# Altium project Hall-Effect-Switch.PrjPcb
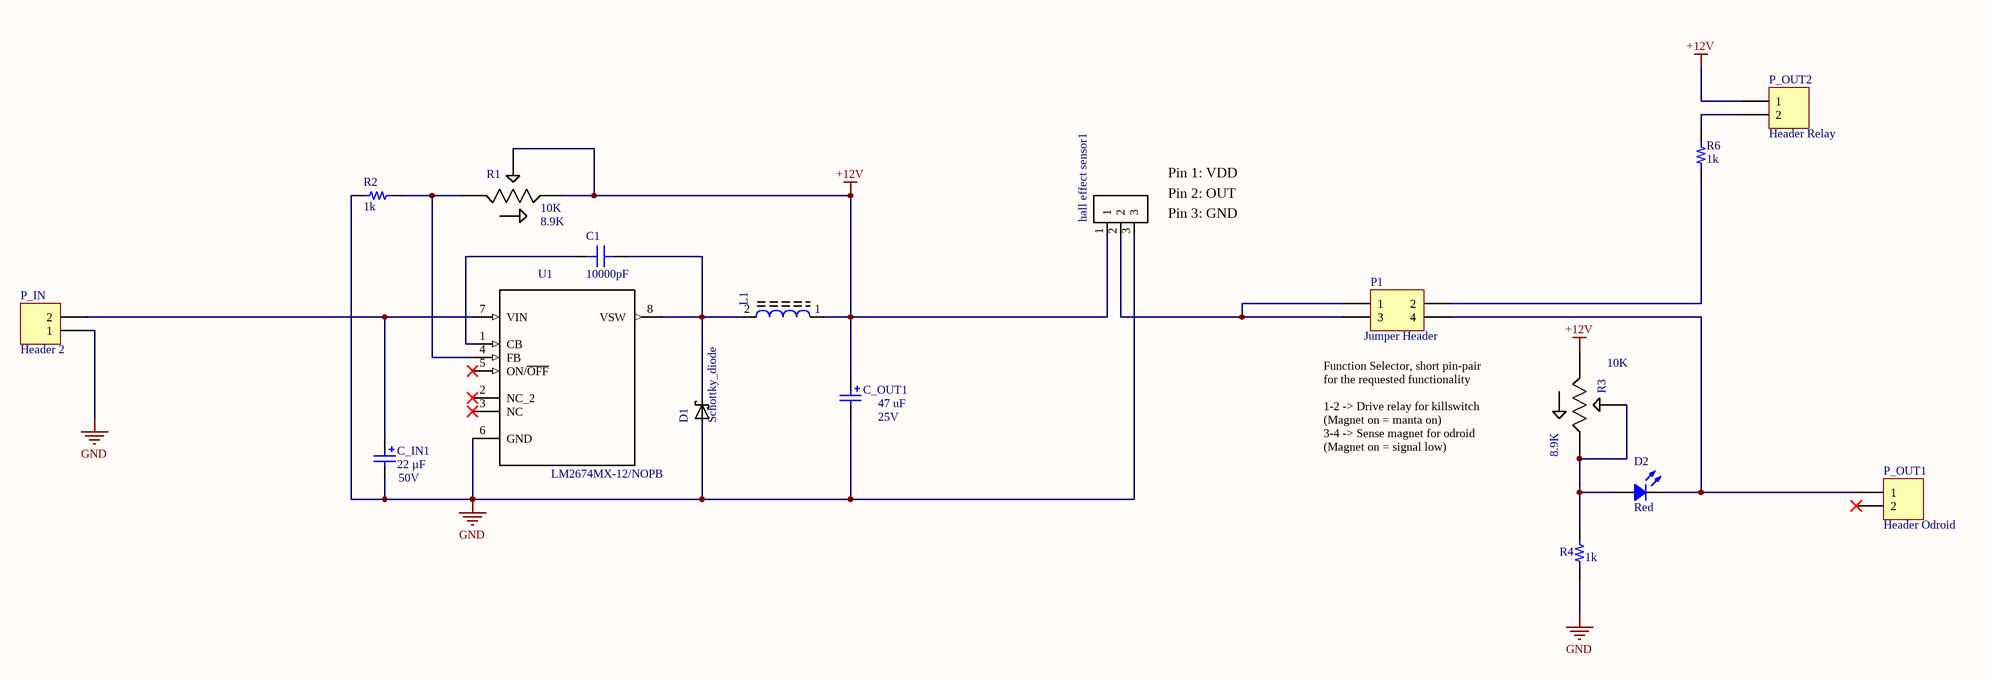
[diagram p0: Hall-Effect-Switch.SchDoc]
1 sheet, 17 parts. Net scope: global (net labels, ports and power ports of the same name join across sheets).
Board file: Hall-Effect-Switch.PcbDoc

## Sheet Hall-Effect-Switch.SchDoc
size A3; CompanyName: VORTEX NTNU

### Parts
C1  10000pF  [CAP 0805/2012]
C_IN1  22 µF  Voltage Rating: 50V  [CAPMP7361X375]
C_OUT1  47 uF  Voltage Rating: 25V  [CAPCP7343X430N]
D1  Schottky_diode  [DIOM7959X250N]
D2  Red  [LED 0603/1608 RED]
hall_effect_sensor1  (no value)  [US5881LSE-AAA-000-RE]
L1  SRR1260-680M  [SRR1260-680M]  (value not drawn)
P1  Jumper Header  [HDR2X2]
P_IN  Header 2  [HDR1X2]
P_OUT1  Header Odroid  [HDR1X2]
P_OUT2  Header Relay  [HDR1X2]
R1  8.9K  value 10K  [*35WR]
R2  1k  [RES 0805/2012]
R3  8.9K  value 10K  [*35WR]
R4  1k  [RES 0805/2012]
R6  1k  [RES 0805/2012]
U1  LM2674MX-12/NOPB  [LM2674MX-12_NOPB]

### Nets
+12V: C_OUT1.1 hall_effect_sensor1.1 L1.1 P_OUT2.1 R1.2 R1.3 R3.1
GND: C_IN1.2 C_OUT1.2 D1.2(A) hall_effect_sensor1.3 P_IN.1 R2.1 R4.1 U1.6(GND)
NetC1_1: C1.1 U1.1(CB)
NetC1_2: C1.2 D1.1(C) L1.2 U1.8(VSW)
NetC_IN1_1: C_IN1.1 P_IN.2 U1.7(VIN)
NetD2_1: D2.1 R3.2 R3.3 R4.2
NetD2_2: D2.2 P1.4 P_OUT1.1
Nethall_effect_sensor1_2: hall_effect_sensor1.2 P1.1 P1.3
NetP1_2: P1.2 R6.1
NetP_OUT2_2: P_OUT2.2 R6.2
NetR1_1: R1.1 R2.2 U1.4(FB)

Not connected (* = marked no-connect by the designer): P_OUT1 2*; U1 2(NC_2)* 3(NC)* 5(ON/~{OFF})*

### Notes on the sheet
- (near hall_effect_sensor1) Pin 1: VDD
- (near hall_effect_sensor1) Pin 2: OUT
- (near hall_effect_sensor1) Pin 3: GND
- (near P1) Function Selector, short pin-pair for the requested functionality
  1-2 -> Drive relay for killswitch (Magnet on = manta on)
  3-4 -> Sense magnet for odroid (Magnet on = signal low)
- Title
- Size
- Author
- Rev
- A3
- Sheet no.
- of

### Library data of the parts
C1 = C2012C0G1H103J060AA: CAP CER 10000PF 50V C0G 0805; Manufacturer: TDK Corporation; TemperatureRange: -55C ~ 125C; TemperatureCoefficient: C0G, NP0; Tolerance: 5%; Value: 10000pF; Part Number: C2012C0G1H103J060AA; PartId: 4634; Supplier 1: Digi-Key; Supplier Part Number 1: 445-7519-2-ND; ComponentLink1Description: Datasheet; ComponentLink1URL: https://product.tdk.com/info/en/catalog/datasheets/mlcc_commercial_general_en.pdf; ComponentLink2Description: Digi-Key listing; ComponentLink2URL: http://digikey.com/product-detail/en/C2012C0G1H103J060AA/445-7519-2-ND/2732954; Voltage: 50V; Price: 0,0876; Type: -; Device Package: 0805 (2012 Metric)
C_IN1 = CAPMP7361X375: Tolerance: ± 10%; Part Number: CAPMP7361X375; Value: 22 µF; ComponentLink1Description: Manufacturer Link; ComponentLink1URL: https://www.digikey.com/en/supplier-centers/a/avx; ComponentLink2Description: Datasheet; ComponentLink2URL: http://datasheets.avx.com/TAJ.pdf; Supplier 1: Digi-Key; Supplier Part Number 1: 478-5811-1-ND; Package: 7361
C_OUT1 = CAPCP7343X430N: Tolerance: ± 10%; Part Number: CAPCP7343X430N; Value: 47 uF; ComponentLink1Description: Manufacturer Link; ComponentLink1URL: https://www.digikey.com/en/supplier-centers/a/avx; ComponentLink2Description: Datasheet; ComponentLink2URL: http://datasheets.avx.com/trj.pdf; Supplier 1: Digi-Key; Supplier Part Number 1: 478-5760-2-ND; Package: 7343
D1 = DIOM7959X250N: General-purpose Schottky diodes; Part Number: DIOM7959X250N; ComponentLink1Description: Manufacturer Link; ComponentLink1URL: https://www.digikey.no/en/supplier-centers/d/diodes; ComponentLink2Description: Datasheet; ComponentLink2URL: https://media.digikey.com/pdf/Data%20Sheets/Diodes%20PDFs/SK32-SK36.pdf; Supplier 1: Digi-key; Supplier Part Number 1: SK35-FDICT-ND
D2 = LTST-C191KRKT: LED RED CLEAR 0603 SMD; Manufacturer: Lite-On Inc.; Value: Green; Millicandela: 54mcd; Voltage Forward: 2V; Current (Test): 20mA; Viewing Angle: 130; Part Number: LTST-C191KRKT; PartId: 7050; Supplier 1: Digi-Key; Supplier Part Number 1: 160-1447-2-ND; ComponentLink1Description: Datasheet; ComponentLink1URL: http://optoelectronics.liteon.com/upload/download/DS22-2000-223/S_110_LTST-C191KRKT.pdf; ComponentLink2Description: Digi-Key Listing; ComponentLink2URL: http://www.digikey.ca/product-detail/en/LTST-C191KRKT/160-1447-2-ND/386837; Price: 0,0521; Device Package: 0603 (1608 Metric); Colour: Red; Lens Transparency: Clear
hall_effect_sensor1 = US5881LSE-AAA-000-RE: Digital Switch Unipolar Switch Open Drain Hall Effect SOT-23; Part Number: US5881LSE-AAA-000-RE; ComponentLink1Description: Manufacturer Link; ComponentLink1URL: https://www.digikey.com/en/supplier-centers/m/melexis; ComponentLink2Description: Datasheet; ComponentLink2URL: https://www.melexis.com/-/media/files/documents/datasheets/us5881-datasheet-melexis.pdf; Supplier 1: Digi-Key; Supplier Part Number 1: US5881LSE-AAA-000-RECT-ND
L1 = SRR1260-680M: Ind Power Shielded Wirewound 68uH 20% 100KHz 22Q-Factor Ferrite 2.1A T/R; MF: Bourns; Value: 68 μH; SnapEDA_Link: https://www.snapeda.com/parts/SRR1260-680M/Bourns/view-part/?ref=snap; Availability: Unavailable; Price: None; MP: SRR1260-680M; Package: Nonstandard Bourns; Part Number: SRR1260-680M; ComponentLink1Description: Manufacturer Link; ComponentLink1URL: https://www.digikey.com/en/supplier-centers/b/bourns; ComponentLink2Description: Datasheet; ComponentLink2URL: https://www.bourns.com/docs/Product-Datasheets/SRR1260.pdf; Supplier 1: Digi-Key; Supplier Part Number 1: SRR1260-680MCT-ND; Irms: 2.1 A
P1 = Header 2X2: Header, 2-Pin, Dual row; LatestRevisionDate: 17-Jul-2002; LatestRevisionNote: Re-released for DXP Platform.; Publisher: Altium Limited
P_IN P_OUT1 P_OUT2 = Header 2: Header, 2-Pin; LatestRevisionDate: 17-Jul-2002; LatestRevisionNote: Re-released for DXP Platform.; Publisher: Altium Limited
R1 R3 = TC33X-2-103E: Res Trimmer 10K Ohm 25% 0.1W_1/10W_ 1_Elec_/1_Mech_Turn _3 X 3.8mm_ Foot Print SMD Embossed T/R; MF: Bourns; MP: TC33X-2-103E; Digi-Key_Purchase_URL: https://www.digikey.com/product-detail/en/bourns-inc/TC33X-2-103E/TC33X-103ECT-ND/612911?utm_source=snapeda&utm_medium=aggregator&utm_campaign=symbol; SnapEDA_Link: https://www.snapeda.com/parts/TC33X-2-103E/Bourns/view-part/?ref=snap; Package: FakePackage u; Digi-Key_Part_Number: TC33X-103ECT-ND; Part Number: TC33X-2-103E; ComponentLink1Description: Manufacturer Link; ComponentLink1URL: https://www.digikey.com/product-detail/en/bourns-inc/TC33X-2-103E/TC33X-103ECT-ND/612911?utm_source=snapeda&utm_medium=aggregator&utm_campaign=symbol; ComponentLink2Description: Datasheet; ComponentLink2URL: https://www.bourns.com/docs/Product-Datasheets/TC33.pdf; Supplier 1: Digi-Key; Supplier Part Number 1: TC33X-103ECT-ND
R2 R4 R6 = ERJ-6ENF1001V: RES SMD 1K OHM 1% 1/8W 0805; Manufacturer: Panasonic Electronic Components; TemperatureRange: -55C ~ 155C; TemperatureCoefficient: 100ppm/C; PowerRating: 0.125W, 1/8W; Value: 1k; Part Number: ERJ-6ENF1001V; PartId: 1948; Supplier 1: Digi-Key; Supplier Part Number 1: P1.00KCTR-ND; ComponentLink1Description: Datasheet; ComponentLink1URL: http://industrial.panasonic.com/www-cgi/jvcr13pz.cgi?E+PZ+3+AOA0002+ERJ6ENF1001V+7+WW; ComponentLink2Description: Digi-Key listing; ComponentLink2URL: http://digikey.com/product-detail/en/ERJ-6ENF1001V/P1.00KCTR-ND/111281; Tolerance: 1%; Price: 0,0073; Type: Thick Film; Device Package: 0805 (2012 Metric)
U1 = LM2674MX-12_NOPB: SIMPLE SWITCHERÂ® 40V, 500mA Low Component Count Step-Down Regulator 8-SOIC -40 to 125; MF: Texas Instruments; Vin,min: 6.5V; Vout,nom: 12V; MP: LM2674MX-12/NOPB; SnapEDA_Link: https://www.snapeda.com/parts/LM2674MX-12/NOPB/Texas%20Instruments/view-part/?ref=snap; Availability: Unavailable; Package: SOIC-8 Texas Instruments; Price: None; Value: *; Part Number: LM2674MX-12_NOPB; ComponentLink1Description: Manufacturer Link; ComponentLink1URL: https://www.digikey.com/en/supplier-centers/t/texas-instruments; ComponentLink2Description: Datasheet; ComponentLink2URL: http://www.ti.com/lit/ds/symlink/lm2674.pdf; Supplier 1: Digi-Key; Supplier Part Number 1: LM2674MX-12/NOPBCT-ND; Vin,max: 40V; Iout,max: 500mA